# EAGLE design LEDboard (EAGLE 5.12)
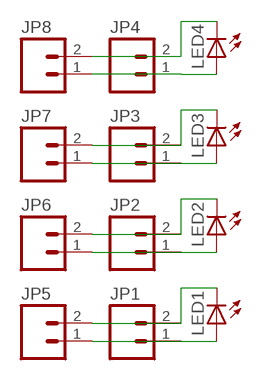
[diagram p0: schematic, sheet 1]

## Parts
JP1  M02JST-PH-V  [JST-2-PH-V]
JP2  M02JST-PH-V  [JST-2-PH-V]
JP3  M02JST-PH-V  [JST-2-PH-V]
JP4  M02JST-PH-V  [JST-2-PH-V]
JP5  M02JST-PH-TH  [JST-2-PH-TH]
JP6  M02JST-PH-TH  [JST-2-PH-TH]
JP7  M02JST-PH-TH  [JST-2-PH-TH]
JP8  M02JST-PH-TH  [JST-2-PH-TH]
LED1  LED5MM  [LED5MM]
LED2  LED5MM  [LED5MM]
LED3  LED5MM  [LED5MM]
LED4  LED5MM  [LED5MM]

## Nets
H1: JP1.1 JP5.1 LED1.A
H2: JP2.1 JP6.1 LED2.A
H3: JP3.1 JP7.1 LED3.A
H4: JP4.1 JP8.1 LED4.A
N$2: JP1.2 JP5.2 LED1.K(C)
N$4: JP2.2 JP6.2 LED2.K(C)
N$6: JP3.2 JP7.2 LED3.K(C)
N$8: JP4.2 JP8.2 LED4.K(C)

## Library data of the parts
JP1-JP8 = GibbotV5:M02: Header 2 Standard 2-pin 0.1" header. Use with straight break away headers (SKU : PRT-00116), right angle break away headers (PRT-00553), swiss pins (PRT-00743), machine pins (PRT-00117), and female headers (PRT-00115). Molex polarized connector foot print use with SKU : PRT-08233 with associated crimp pins and housings.
LED1-LED4 = GibbotV5:LED: LEDs Standard schematic elements and footprints for 5mm, 3mm, 1206, and 0603 sized LEDs. 5mm - Spark Fun Electronics SKU : COM-00529 (and others)

## Board
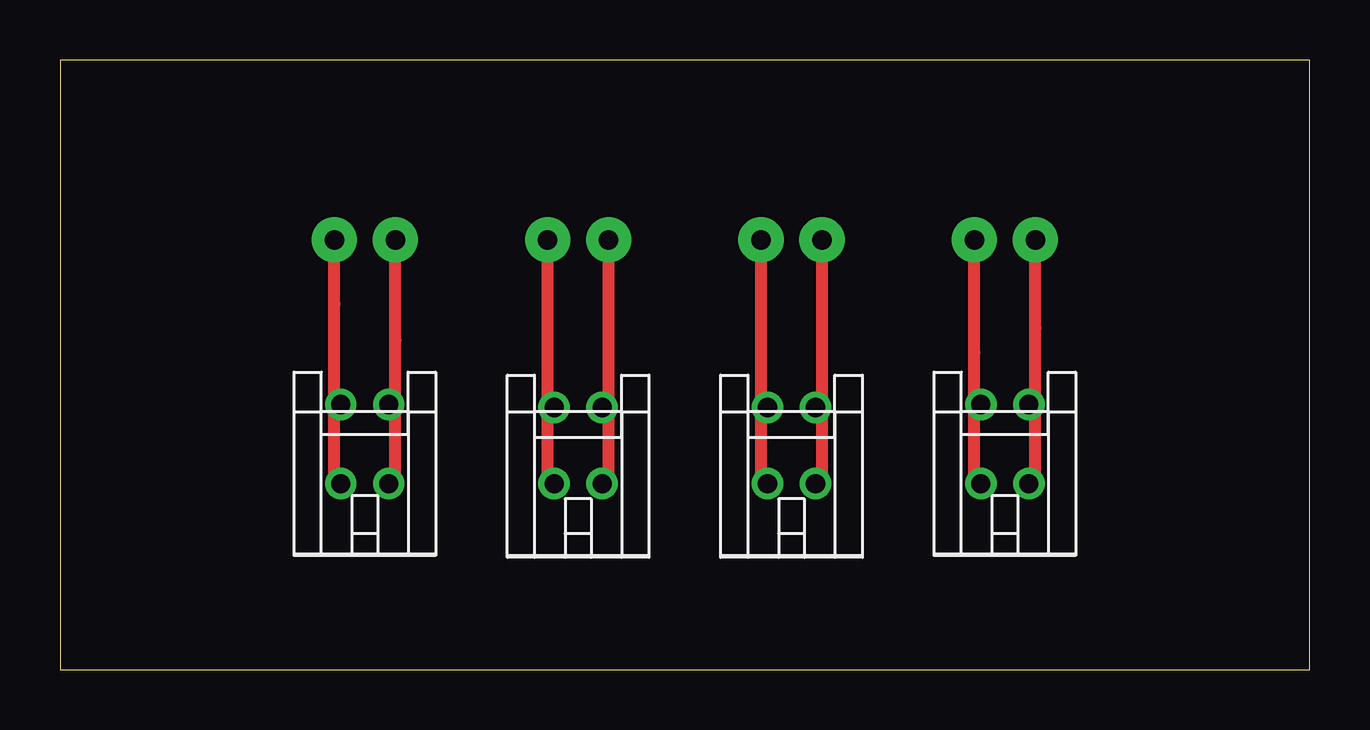
[diagram p1: board, top side]
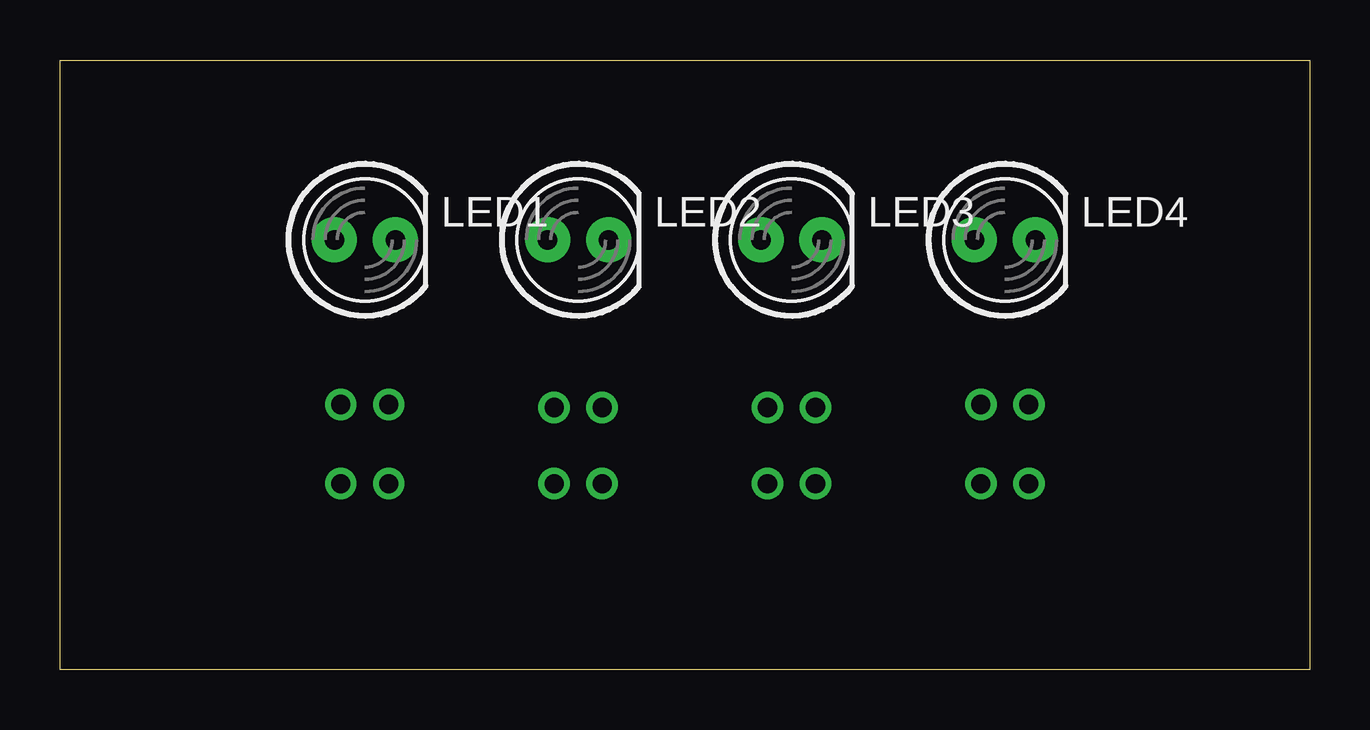
[diagram p2: board, bottom side, seen from below]

Size 52.07 x 25.4 mm. Coordinates in mm from the lower left corner, seen from the top.
Outline: 0,0 52.07,0 52.07,25.4 0,25.4 0,0
Copper layers (1*16): Top 0.035mm / dielectric 1.5mm / Bottom 0.035mm
Design rules "default": minimum track width 10mil, minimum drill 24mil, track to track 8mil, track to pad 8mil, pad to pad 8mil, via to via 8mil, smd to smd 8mil, copper to edge 40mil, drill to drill 8mil, minimum pad ring 10mil, minimum via ring 8mil, stop-mask expansion 4mil, vias tented up to drill 0mil, thermal gap 10mil

### Footprints (pad centres in the part's own frame; a part is rotated, then mirrored left to right if it is on the bottom)
JST-2-PH-V = drill 0.8 round: 1 -1,0; 2 1,0
JST-2-PH-TH = drill 0.8 round: 1 -1,-6.35; 2 1,-6.35
LED5MM = drill 0.813 pad 1.88 round: A -1.27,0; K 1.27,0

### Placement (x,y rotation side)
JP1  39.37,7.75 180 top
JP2  30.48,7.75 180 top
JP3  21.59,7.75 180 top
JP4  12.7,7.75 180 top
JP5  39.37,4.7 180 top
JP6  30.48,4.57 180 top
JP7  21.59,4.57 180 top
JP8  12.7,4.7 180 top
LED1  39.37,17.91 0 bottom
LED2  30.48,17.91 0 bottom
LED3  21.59,17.91 0 bottom
LED4  12.7,17.91 0 bottom

### Tracks (layer width: path | path; a pad name or v marks a point on that pad's centre or on a via)
H1
  Top 0.508: JP1.1 arc90 40.64,8.02 40.64,11.32 | LED1.A 40.64,14.22 40.64,11.32 | 40.64,11.32 arc-90 JP5.1
H2
  Top 0.508: JP2.1 arc90 31.75,8.02 31.75,11.19 | LED2.A 31.75,12.83 31.75,11.19 | 31.75,11.19 arc-90 JP6.1
H3
  Top 0.508: JP3.1 arc90 22.86,8.02 22.86,11.19 | LED3.A 22.86,13.46 22.86,11.19 | 22.86,11.19 arc-90 JP7.1
H4
  Top 0.508: JP4.1 arc90 13.97,8.02 13.97,11.32 | LED4.A 13.97,13.72 13.97,11.32 | 13.97,11.32 arc-90 JP8.1
N$2
  Top 0.508: JP1.2 arc-90 38.1,8.02 38.1,11.32 | LED1.K 38.1,13.21 38.1,11.32 | 38.1,11.32 arc90 JP5.2
N$4
  Top 0.508: JP2.2 arc-90 29.21,8.02 29.21,11.19 | LED2.K 29.21,14.1 29.21,11.19 | 29.21,11.19 arc90 JP6.2
N$6
  Top 0.508: JP3.2 arc-90 20.32,8.02 20.32,11.19 | LED3.K 20.32,12.95 20.32,11.19 | 20.32,11.19 arc90 JP7.2
N$8
  Top 0.508: JP4.2 arc-90 11.43,8.02 11.43,11.32 | LED4.K 11.43,15.24 11.43,11.32 | 11.43,11.32 arc90 JP8.2